# EAGLE board ProiectTSC (EAGLE 9.7.0)
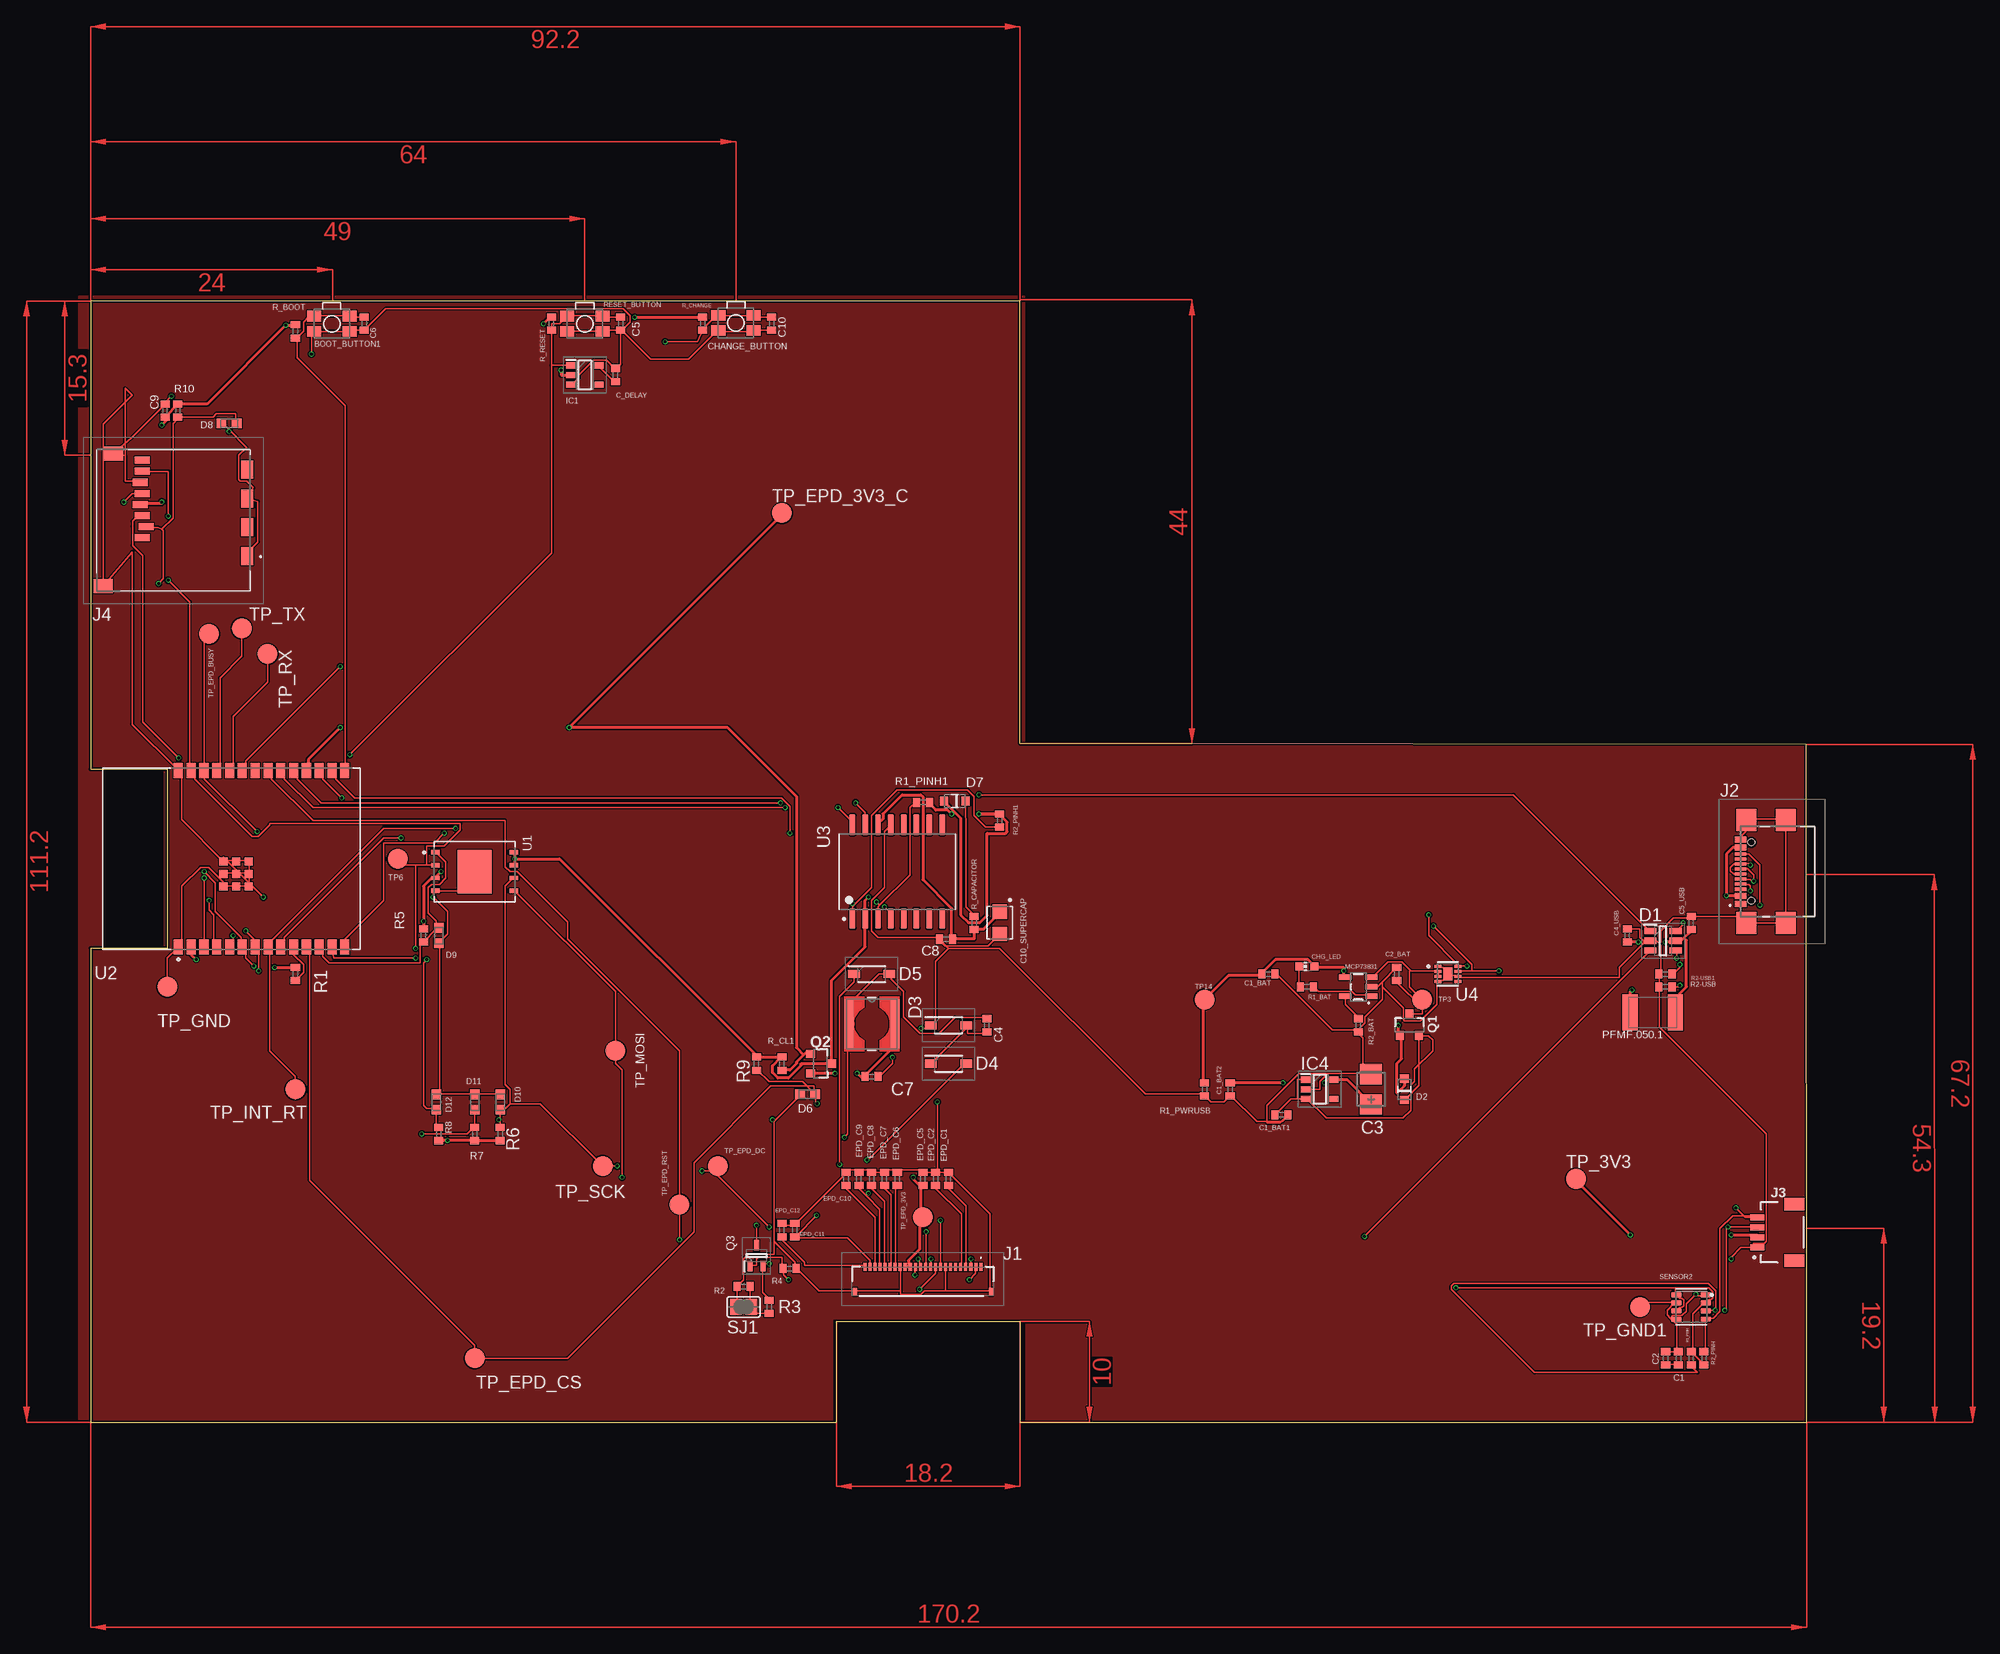
[diagram p3: board, top side]
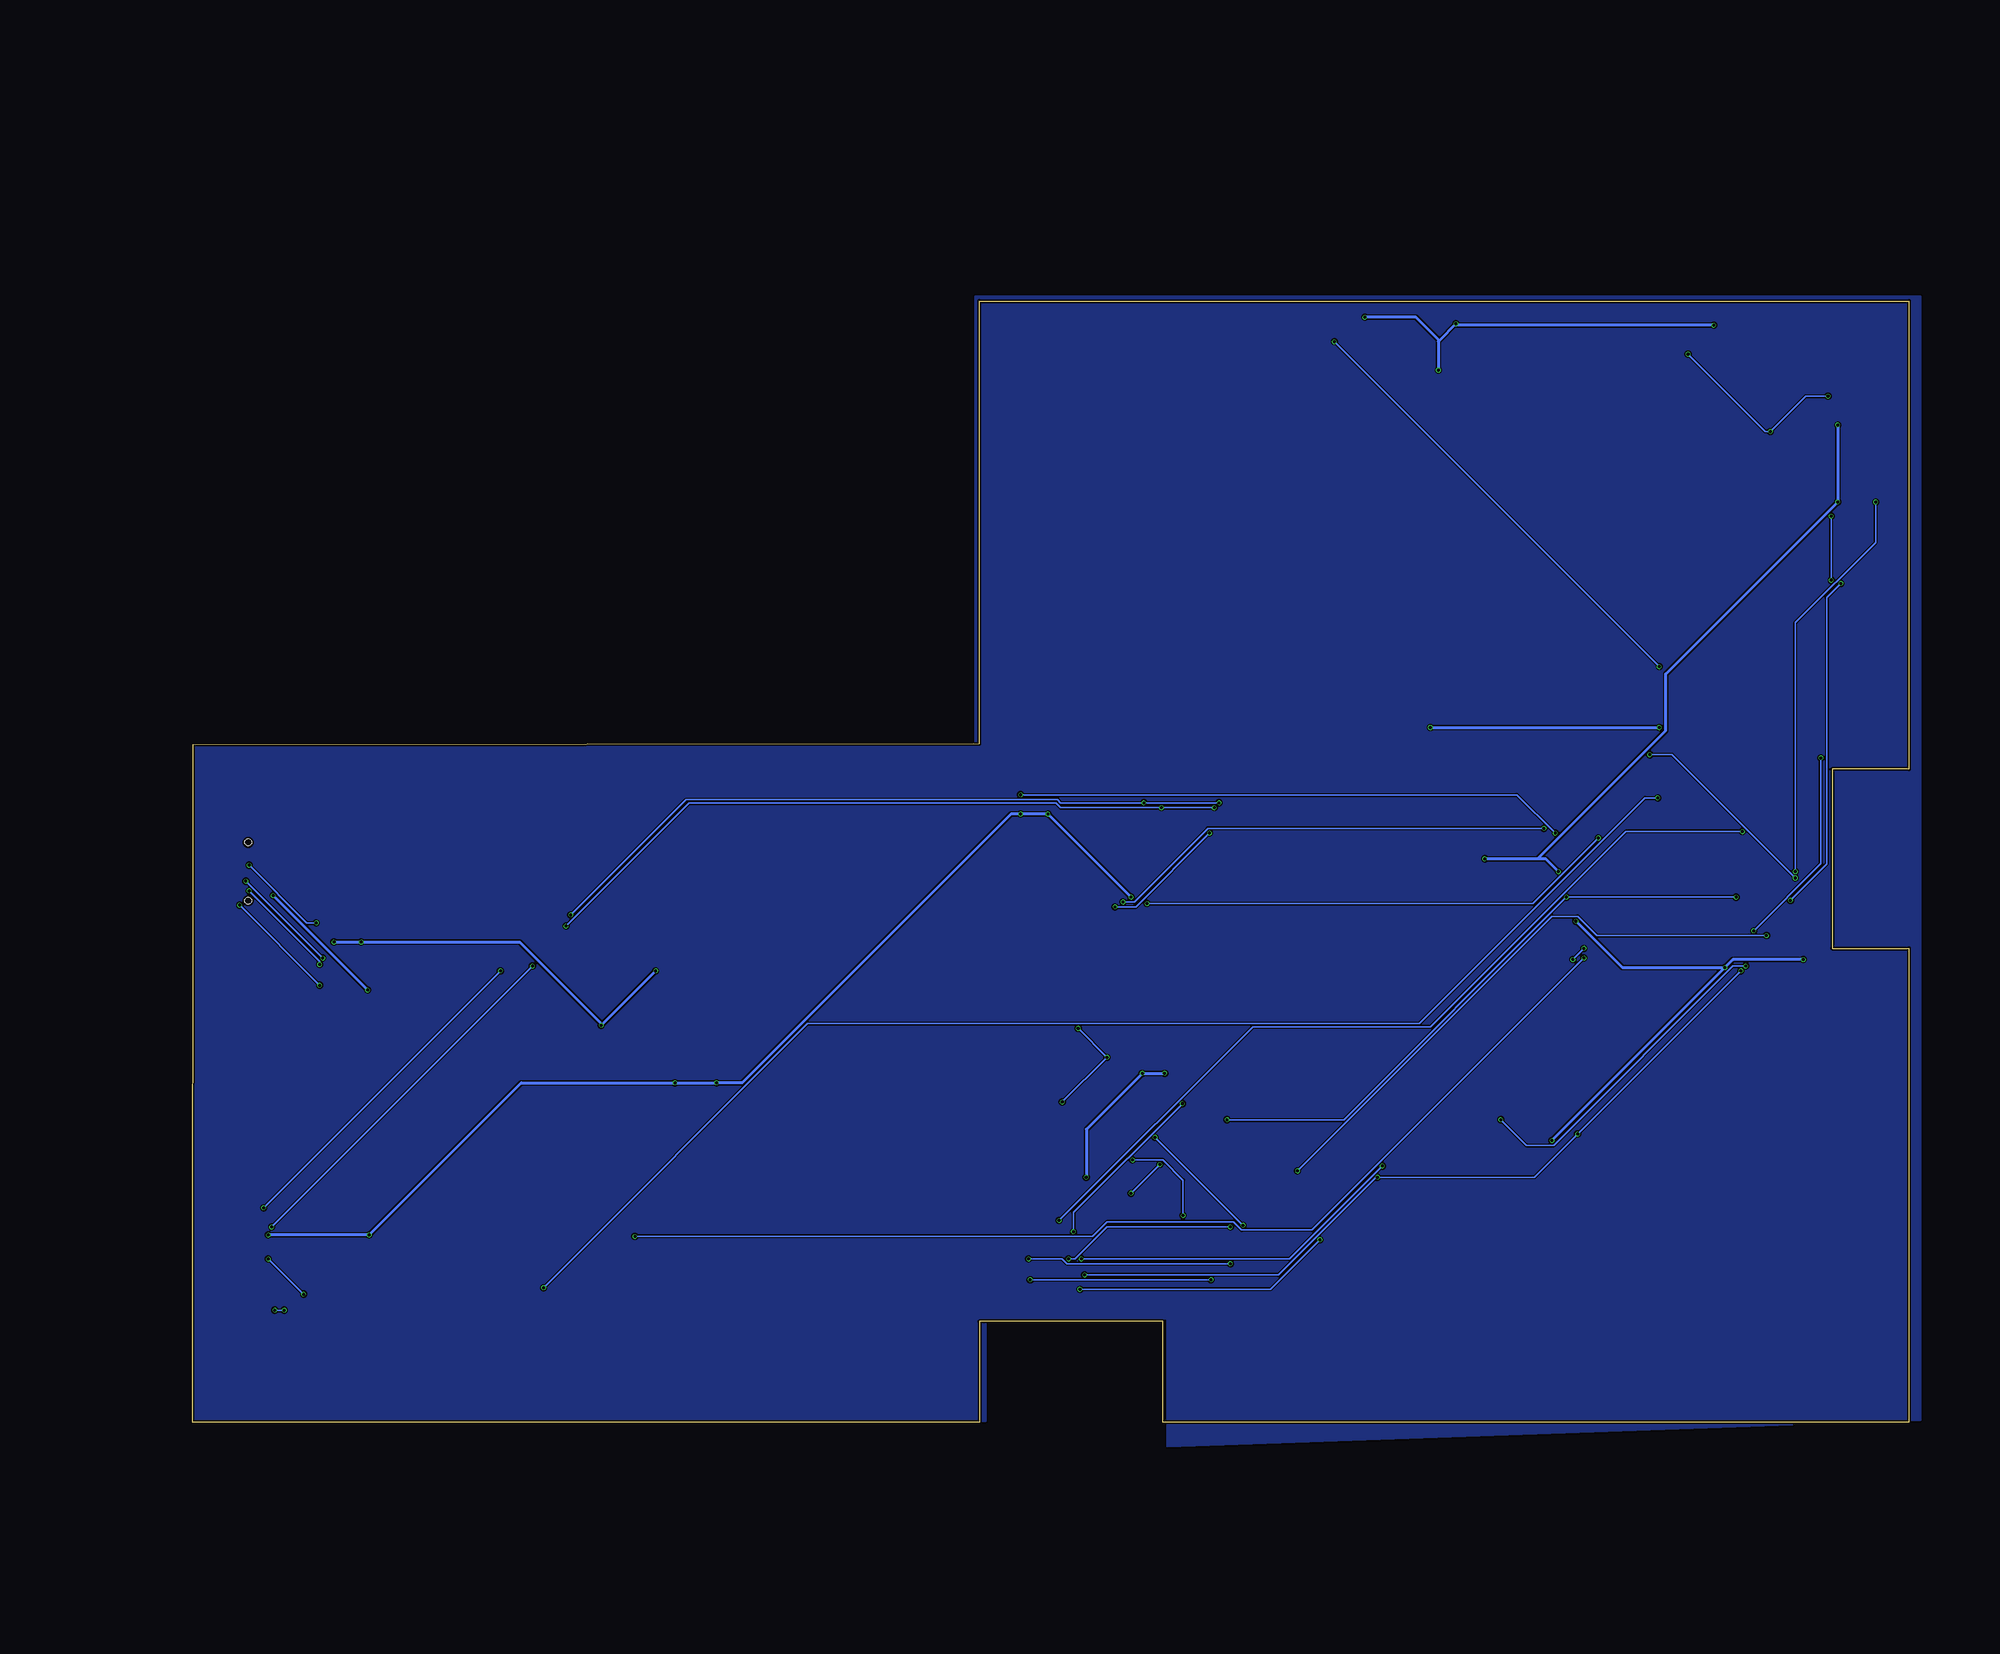
[diagram p4: board, bottom side, seen from below]

Size 170.2 x 111.2 mm. Coordinates in mm from the lower left corner, seen from the top.
Outline: 0,46.99 0,0 74,0 74,10 92.2,10 92.2,0 170.2,0 170.16,67.2 92.2,67.31 92.2,111.2 0,111.2 0,64.77 7.62,64.77 7.62,46.99 0,46.99
Copper layers (1*16): Top 0.035mm / dielectric 1.6mm / Bottom 0.035mm
Design rules "jlcpcb-2layers.dru": minimum track width 5mil, minimum drill 0.3mm, track to track 5mil, track to pad 5mil, pad to pad 5mil, via to via 5mil, smd to smd 5mil, copper to edge 0.2mm, drill to drill 6mil, minimum pad ring 10mil, minimum via ring 3mil, stop-mask expansion 4mil, vias tented up to drill 0mil, thermal gap 10mil
Net classes: 0 default: width 0.15 mm; 1 POWER: width 0.3 mm

## Footprints (pad centres in the part's own frame; a part is rotated, then mirrored left to right if it is on the bottom)
MYBUTTON = smd 1.4 x 1.05: 1 1.75,0.75; 2 -1.75,0.75; 3 -1.75,-0.75; 4 1.75,-0.75
EAGLE-LTSPICE_C0402 = smd 0.7 x 0.9: 1 -0.65,0; 2 0.65,0
ESP32_WROVER_EAGLE-LTSPICE_C0402 = smd 0.7 x 0.9: 1 -0.65,0; 2 0.65,0
RCL_CT3528 = smd 2 x 2.2: + -1.5,0; - 1.5,0
CAPCP3225X100N = smd 1.4 x 1.4: 1 -1.1,0; 2 1.1,0
ADAFRUIT_CHIP-LED0603 = smd 0.8 x 0.8: A 0,-0.75; C 0,0.75
SOT95P280X145-6N = smd 1.2 x 0.6: 1 -1.25,0.95; 2 -1.25,0; 3 -1.25,-0.95; 4 1.25,-0.95; 5 1.25,0; 6 1.25,0.95
ESP32_WROVER_AVX---SD0805S020S1R0_AVX_SD0805S020S1R0_0 = smd 0.8 x 0.9: 1 -1.05,0; 2 1.05,0
SOD3716X135N = smd 1.15 x 0.8: 1 -1.75,0; 2 1.75,0
DIOC1608X36N = smd 0.97 x 0.94: 1 -0.75,0; 2 0.75,0
SOT95P280X125-5N = smd 0.9 x 0.6: 1 -1.4,0.95; 2 -1.4,0; 3 -1.4,-0.95; 4 1.4,-0.95; 5 1.4,0.95
SOT95P280X120-5N = smd 0.9 x 0.6: 1 -1.4,0.95; 2 -1.4,0; 3 -1.4,-0.95; 4 1.4,-0.95; 5 1.4,0.95
FH34SRJ24S05SH99 = smd 0.3 x 0.8: 1 5.75,1.45; 2 5.25,1.45; 3 4.75,1.45; 4 4.25,1.45; 5 3.75,1.45; 6 3.25,1.45; 7 2.75,1.45; 8 2.25,1.45; 9 1.75,1.45; 10 1.25,1.45; 11 0.75,1.45; 12 0.25,1.45; 13 -0.25,1.45; 14 -0.75,1.45; 15 -1.25,1.45; 16 -1.75,1.45; 17 -2.25,1.45; 18 -2.75,1.45; 19 -3.25,1.45; 20 -3.75,1.45; 21 -4.25,1.45; 22 -4.75,1.45; 23 -5.25,1.45; 24 -5.75,1.45 | smd 0.4 x 0.8: MP1 6.75,-1.05; MP2 -6.75,-1.05
SAMACSYS_PARTS_USB4110GFA = smd 0.3 x 1.15: A1 -3.35,3.678; A4 -2.55,3.678; A5 -1.25,3.678; A6 -0.25,3.678; A7 0.25,3.678; A8 1.25,3.678; A9 2.55,3.678; A12 3.35,3.678; B1 3.05,3.678; B4 2.25,3.678; B5 1.75,3.678; B6 0.75,3.678; B7 -0.75,3.678; B8 -1.75,3.678; B9 -2.25,3.678; B12 -3.05,3.678 | smd 2.18 x 2: MP1 -5.11,-0.827; MP2 5.11,-0.827; MP3 -5.11,3.103; MP4 5.11,3.103 | hole 0.65: -2.89,2.603; 2.89,2.603
JST04_1MM_RA = smd 0.6 x 1.35: 1 -1.5,0; 2 -0.5,0; 3 0.5,0; 4 1.5,0 | smd 1.2 x 2: NC1 2.8,-3.675; NC2 -2.8,-3.675
112ATAARR03ATTEND = smd 1.8 x 1.2: G1 10.6,10.4; G2 4.9,10.4; S1 7.75,10.4; S2 2.05,10.4 | smd 1.4 x 1.9: G3 13.6,-3.85; G4 0.45,-2.85 | smd 0.7 x 1.5: P1 8.8,0; P2 7.7,0.4; P3 6.6,0; P4 5.5,-0.2; P5 4.4,0; P6 3.3,-0.2; P7 2.2,0; P8 1.1,0
IND_4828-WE-TPC_WRE = smd 0.889 x 4.826: 1 -2.286,0; 2 2.286,0
ESP32_WROVER_SPARKFUN-IC-POWER_SOT23-5 = smd 0.55 x 1.2: 1 -0.95,-1.3; 2 0,-1.3; 3 0.95,-1.3; 4 0.95,1.3; 5 -0.95,1.3
ESP32C6_VARISTOR_CT/CN1812 = smd 1.5 x 3.6: 1 -2.25,0; 2 2.25,0
ESP32_WROVER_SPARKFUN-DISCRETESEMI_SOT23-3 = smd 0.8 x 0.9: 1 -0.95,-1; 2 0.95,-1; 3 0,1.1
SOT65P210X110-3N = smd 1.05 x 0.5: 1 -1.05,0.65; 2 -1.05,-0.65; 3 1.05,0
ESP32_WROVER_EAGLE-LTSPICE_R0402 = smd 0.7 x 0.9: 1 -0.65,0; 2 0.65,0
ESP32_WROVER_BME680_PSON80P300X300X100-8N = smd 1.016 x 0.5: 1 1.458,1.2; 2 1.458,0.4; 3 1.458,-0.4; 4 1.458,-1.2; 5 -1.458,-1.22; 6 -1.458,-0.4; 7 -1.458,0.4; 8 -1.458,1.2
SJ = smd 1.168 x 1.6: 1 -0.762,0; 2 0.762,0
TP20R = smd 2 x 2: TP 0,0
SON127P600X800X80-9N = smd 0.94 x 0.44: 1 -3.895,1.905; 2 -3.895,0.635; 3 -3.895,-0.635; 4 -3.895,-1.905; 5 3.895,-1.905; 6 3.895,-0.635; 7 3.895,0.635; 8 3.895,1.905 | smd 3.4 x 4.3: 9 0,0
XCVR_ESP32-C6-WROOM-1-N8 = smd 1.5 x 0.9: 1 -8.75,5.26; 2 -8.75,3.99; 3 -8.75,2.72; 4 -8.75,1.45; 5 -8.75,0.18; 6 -8.75,-1.09; 7 -8.75,-2.36; 8 -8.75,-3.63; 9 -8.75,-4.9; 10 -8.75,-6.17; 11 -8.75,-7.44; 12 -8.75,-8.71; 13 -8.75,-9.98; 14 -8.75,-11.25; 15 8.75,-11.25; 16 8.75,-9.98; 17 8.75,-8.71; 18 8.75,-7.44; 19 8.75,-6.17; 20 8.75,-4.9; 21 8.75,-3.63; 22 8.75,-2.36; 23 8.75,-1.09; 24 8.75,0.18; 25 8.75,1.45; 26 8.75,2.72; 27 8.75,3.99; 28 8.75,5.26 | smd 0.8 x 0.8: 29_1 -2.755,0.79; 29_2 -1.505,0.79; 29_3 -0.255,0.79; 29_4 -2.755,-0.46; 29_5 -1.505,-0.46; 29_6 -0.255,-0.46; 29_7 -2.755,-1.71; 29_8 -1.505,-1.71; 29_9 -0.255,-1.71
SOIC127P1032X265-16N = smd 2.05 x 0.59: 1 -4.655,4.445; 2 -4.655,3.175; 3 -4.655,1.905; 4 -4.655,0.635; 5 -4.655,-0.635; 6 -4.655,-1.905; 7 -4.655,-3.175; 8 -4.655,-4.445; 9 4.655,-4.445; 10 4.655,-3.175; 11 4.655,-1.905; 12 4.655,-0.635; 13 4.655,0.635; 14 4.655,1.905; 15 4.655,3.175; 16 4.655,4.445
SON50P200X200X80-9N = smd 0.76 x 0.27: 1 -0.985,0.75; 2 -0.985,0.25; 3 -0.985,-0.25; 4 -0.985,-0.75; 5 0.985,-0.75; 6 0.985,-0.25; 7 0.985,0.25; 8 0.985,0.75 | smd 0.9 x 1.3: 9 0,0

## Placement (x,y rotation side)
BOOT_BUTTON1  BUTTON_CUSYOMV1  [MYBUTTON]  23.93,108.95 180 top
C1  100nF  [EAGLE-LTSPICE_C0402]  157.48,6.35 90 top
C1_BAT  4.7uF  [ESP32_WROVER_EAGLE-LTSPICE_C0402]  116.84,44.45 0 top
C1_BAT1  4.7uF  [ESP32_WROVER_EAGLE-LTSPICE_C0402]  118.11,30.48 0 top
C1_BAT2  4.7uF  [ESP32_WROVER_EAGLE-LTSPICE_C0402]  113.03,33.02 270 top
C2  100nF  [EAGLE-LTSPICE_C0402]  156.21,6.35 90 top
C2_BAT  4.7uF  [EAGLE-LTSPICE_C0402]  129.54,44.45 90 top
C3  100uF  [RCL_CT3528]  127,33.02 90 top
C4  4.7uF/25V  [ESP32_WROVER_EAGLE-LTSPICE_C0402]  88.9,39.37 90 top
C4_USB  100nF  [EAGLE-LTSPICE_C0402]  152.4,48.26 90 top
C5  1uF  [EAGLE-LTSPICE_C0402]  52.58,108.95 270 top
C5_USB  4.7uF  [EAGLE-LTSPICE_C0402]  158.75,49.53 90 top
C6  100nF  [EAGLE-LTSPICE_C0402]  27.14,108.95 270 top
C7  10uF  [ESP32_WROVER_EAGLE-LTSPICE_C0402]  77.47,34.29 0 top
C8  100nF  [EAGLE-LTSPICE_C0402]  84.84,47.9 180 top
C9  100nF  [EAGLE-LTSPICE_C0402]  7.39,100.33 90 top
C10  100nF  [EAGLE-LTSPICE_C0402]  67.56,108.95 270 top
C10_SUPERCAP  CPH3225A  [CAPCP3225X100N]  90.17,49.53 270 top
C_DELAY  100nF  [EAGLE-LTSPICE_C0402]  52.07,103.87 90 top
CHANGE_BUTTON  BUTTON_CUSYOMV1  [MYBUTTON]  64.01,109.04 180 top
CHG_LED  [ADAFRUIT_CHIP-LED0603]  120.65,45.21 90 top
D1  USBLC6-2SC6Y  [SOT95P280X145-6N]  155.96,47.75 0 top
D2  ESP32_WROVER_AVX---SD0805S020S1R0_AVX_SD0805S020S1R0_0_0AVX_SD0805S020S1R0_0_0  [ESP32_WROVER_AVX---SD0805S020S1R0_AVX_SD0805S020S1R0_0]  130.3,33.02 90 top
D3  MBR0530  [SOD3716X135N]  85.09,39.37 0 top
D4  MBR0530  [SOD3716X135N]  85.09,35.56 0 top
D5  MBR0530  [SOD3716X135N]  77.47,44.45 0 top
D6  PGB1010603MR  [DIOC1608X36N]  71.12,32.51 0 top
D7  ESP32_WROVER_AVX---SD0805S020S1R0_AVX_SD0805S020S1R0_0_0AVX_SD0805S020S1R0_0_0  [ESP32_WROVER_AVX---SD0805S020S1R0_AVX_SD0805S020S1R0_0]  85.71,61.59 180 top
D8  PGB1010603MR  [DIOC1608X36N]  13.74,99.06 0 top
D9  PGB1010603MR  [DIOC1608X36N]  34.54,48.26 90 top
D10  PGB1010603MR  [DIOC1608X36N]  40.64,31.75 270 top
D11  PGB1010603MR  [DIOC1608X36N]  38.1,31.75 270 top
D12  PGB1010603MR  [DIOC1608X36N]  34.29,31.75 270 top
EPD_C1  1uF/50V  [EAGLE-LTSPICE_C0402]  85.09,24.13 90 top
EPD_C2  1uF/50V  [EAGLE-LTSPICE_C0402]  83.82,24.13 90 top
EPD_C5  0.1uF/50V  [EAGLE-LTSPICE_C0402]  82.55,24.13 90 top
EPD_C6  1uF/50V  [EAGLE-LTSPICE_C0402]  80.01,24.13 90 top
EPD_C7  1uF/50V  [EAGLE-LTSPICE_C0402]  78.74,24.13 90 top
EPD_C8  1uF/50V  [EAGLE-LTSPICE_C0402]  77.47,24.13 90 top
EPD_C9  1uF/50V  [EAGLE-LTSPICE_C0402]  76.2,24.13 90 top
EPD_C10  1uF/50V  [EAGLE-LTSPICE_C0402]  74.93,24.13 90 top
EPD_C11  1uF/50V  [EAGLE-LTSPICE_C0402]  69.85,19.05 90 top
EPD_C12  1uF/50V  [EAGLE-LTSPICE_C0402]  68.58,19.05 90 top
IC1  BD5229G-TR  [SOT95P280X125-5N]  49.02,103.87 0 top
IC4  XC6220A331MR-G  [SOT95P280X120-5N]  121.92,33.02 0 top
J1  FH34SRJ-24S-0.5SH_99_  [FH34SRJ24S05SH99]  82.55,13.97 0 top
J2  SAMACSYS_PARTS_USB4110-GF-A  [SAMACSYS_PARTS_USB4110GFA]  167.32,54.61 90 top
J3  QWIIC_RIGHT_ANGLE  [JST04_1MM_RA]  165.31,18.83 90 top
J4  112A-TAAR-R03_ATTEND  [112ATAARR03ATTEND]  5.12,96.52 270 top
L1  68uH  [IND_4828-WE-TPC_WRE]  77.5,39.5 0 top
MCP73831  ESP32_WROVER_SPARKFUN-IC-POWER_MCP73831  [ESP32_WROVER_SPARKFUN-IC-POWER_SOT23-5]  125.73,43.18 90 top
PFMF.050.1  ESP32C6_VARISTORCN1812  [ESP32C6_VARISTOR_CT/CN1812]  154.94,40.64 0 top
Q1  20V/4.2A/52mΩ/1.4W  [ESP32_WROVER_SPARKFUN-DISCRETESEMI_SOT23-3]  130.81,39.37 0 top
Q2  20V/4.2A/52mΩ/1.4W  [ESP32_WROVER_SPARKFUN-DISCRETESEMI_SOT23-3]  72.39,35.56 270 top
Q3  SI1308EDL-T1-GE3  [SOT65P210X110-3N]  66.04,16.51 90 top
R1  10k  [ESP32_WROVER_EAGLE-LTSPICE_R0402]  20.32,44.45 90 top
R1_BAT  200  [ESP32_WROVER_EAGLE-LTSPICE_R0402]  120.65,43.18 0 top
R1_PINH  10K  [ESP32_WROVER_EAGLE-LTSPICE_R0402]  158.75,6.35 90 top
R1_PINH1  10K  [ESP32_WROVER_EAGLE-LTSPICE_R0402]  82.55,61.47 0 top
R1_PWRUSB  10K  [ESP32_WROVER_EAGLE-LTSPICE_R0402]  110.49,33.02 90 top
R2  2.2  [ESP32_WROVER_EAGLE-LTSPICE_R0402]  64.77,13.46 0 top
R2-USB  5k1  [ESP32_WROVER_EAGLE-LTSPICE_R0402]  156.21,43.18 180 top
R2-USB1  5k1  [ESP32_WROVER_EAGLE-LTSPICE_R0402]  156.21,44.45 0 top
R2_BAT  2k  [ESP32_WROVER_EAGLE-LTSPICE_R0402]  125.73,39.37 90 top
R2_PINH  10K  [ESP32_WROVER_EAGLE-LTSPICE_R0402]  160.02,6.35 270 top
R2_PINH1  10K  [ESP32_WROVER_EAGLE-LTSPICE_R0402]  90.17,59.69 90 top
R3  0.47  [ESP32_WROVER_EAGLE-LTSPICE_R0402]  67.31,11.43 90 top
R4  10K  [ESP32_WROVER_EAGLE-LTSPICE_R0402]  69.34,15.24 180 top
R5  10K  [ESP32_WROVER_EAGLE-LTSPICE_R0402]  33.02,48.26 90 top
R6  10K  [ESP32_WROVER_EAGLE-LTSPICE_R0402]  40.64,28.57 270 top
R7  10K  [ESP32_WROVER_EAGLE-LTSPICE_R0402]  38.1,28.57 270 top
R8  10K  [ESP32_WROVER_EAGLE-LTSPICE_R0402]  34.54,28.57 270 top
R9  10K  [ESP32_WROVER_EAGLE-LTSPICE_R0402]  66.04,35.56 90 top
R10  10K  [ESP32_WROVER_EAGLE-LTSPICE_R0402]  8.66,100.33 90 top
R_BOOT  10K  [ESP32_WROVER_EAGLE-LTSPICE_R0402]  20.32,108.19 90 top
R_CAPACITOR  15  [ESP32_WROVER_EAGLE-LTSPICE_R0402]  87.63,49.53 270 top
R_CHANGE  10K  [ESP32_WROVER_EAGLE-LTSPICE_R0402]  60.71,108.95 90 top
R_CL1  10K  [ESP32_WROVER_EAGLE-LTSPICE_R0402]  68.58,35.56 90 top
R_RESET  10K  [ESP32_WROVER_EAGLE-LTSPICE_R0402]  45.72,108.95 90 top
RESET_BUTTON  BUTTON_CUSYOMV1  [MYBUTTON]  49.02,108.95 180 top
SENSOR2  ESP32_WROVER_BME680_BME680  [ESP32_WROVER_BME680_PSON80P300X300X100-8N]  158.75,11.43 0 top
SJ1  [SJ]  64.77,11.43 0 top
TP3  TPTP20R  [TP20R]  132.08,41.91 0 top
TP6  TPTP20R  [TP20R]  30.48,55.88 0 top
TP14  TPTP20R  [TP20R]  110.49,41.91 0 top
TP_3V3  TPTP20R  [TP20R]  147.32,24.13 0 top
TP_EPD_3V3  TPTP20R  [TP20R]  82.55,20.32 0 top
TP_EPD_3V3_C  TPTP20R  [TP20R]  68.58,90.17 0 top
TP_EPD_BUSY  TPTP20R  [TP20R]  11.76,78.18 0 top
TP_EPD_CS  TPTP20R  [TP20R]  38.1,6.35 0 top
TP_EPD_DC  TPTP20R  [TP20R]  62.23,25.4 0 top
TP_EPD_RST  TPTP20R  [TP20R]  58.42,21.59 0 top
TP_GND  TPTP20R  [TP20R]  7.62,43.18 0 top
TP_GND1  TPTP20R  [TP20R]  153.67,11.43 0 top
TP_INT_RT  TPTP20R  [TP20R]  20.32,33.02 0 top
TP_MOSI  TPTP20R  [TP20R]  52.07,36.83 0 top
TP_RX  TPTP20R  [TP20R]  17.55,76.2 0 top
TP_SCK  TPTP20R  [TP20R]  50.8,25.4 0 top
TP_TX  TPTP20R  [TP20R]  15.01,78.74 0 top
U1  W25Q512JVEIQ  [SON127P600X800X80-9N]  38.1,54.61 0 top
U2  ESP32-C6-WROOM-1-N8  [XCVR_ESP32-C6-WROOM-1-N8]  13.97,55.88 90 top
U3  DS3231SN#  [SOIC127P1032X265-16N]  80.01,54.61 90 top
U4  MAX17048G+T10  [SON50P200X200X80-9N]  134.62,44.45 0 top

## Tracks (layer width: path | path; a pad name or v marks a point on that pad's centre or on a via)
3V3  (via drill 0.3)
  Top 0.3: IC1.2 46.67,103.87 v46.67,104.35 | v44.93,108.95 45.72,109.74 R_RESET.2 | v53.98,109.58 60.64,109.58 R_CHANGE.2 | R_BOOT.2 20.32,108.79 v19.37,108.79 11.56,100.98 R10.2 8.66,100.97 7.39,99.69 C9.1 7.55,99.69 7.55,99.38 v7.07,98.9 | v7.07,91.28 7.07,91.12 4.96,91.12 J4.P4 | v118.27,33.66 113.03,33.66 C1_BAT2.1 | v122.4,33.66 122.71,33.97 123.19,33.97 IC4.5 123.35,33.97 124.62,33.97 127,31.59 C3.+ | v162.72,18.57 165.31,18.57 J3.2 | v152.72,18.57 147.32,23.97 TP_3V3.TP | R2_PINH1.2 90.17,60.33 v88.11,60.33 90.08,60.33 90.9,59.51 90.9,58.58 90.73,58.41 88.92,58.41 88.92,50.27 88.19,49.55 87.06,49.55 86.29,50.33 86.29,59.91 84.66,61.55 D7.2 | v77.15,52.07 76.83,51.75 U3.2 76.83,47.15 73.5,43.81 73.5,35.56 Q2.3 70.48,35.56 70.48,35.4 69.22,34.13 68.17,34.13 67.63,34.67 67.63,35.36 68.48,36.21 R_CL1.2 68.58,36.2 66.04,36.2 R9.2 66.04,36.35 46.51,55.88 v42.07,55.88 | v42.07,55.88 42.07,56.52 U1.8 | v42.07,55.88 42.07,55.24 U1.7 | R5.2 v33.02,49.69 33.02,53.18 33.81,53.98 U1.3 34.29,53.98 34.29,54.13 v34.77,54.61 | R7.2 v35.4,27.94 34.61,27.94 R8.2 | R7.2 R6.2 | R7.2 | v18.26,45.09 20.32,45.09 R1.2 | v10.48,45.88 10,46.35 10,46.99 U2.2 | v85.41,60.33 85.02,60.72 83.85,60.72 83.2,61.37 R1_PINH1.2
  Bottom 0.3: v46.67,104.35 46.67,107.2 46.59,107.28 | 46.59,107.28 v44.93,108.95 44.93,108.79 v19.37,108.79 | v53.98,109.58 48.9,109.58 46.59,107.28 | v7.07,98.9 v7.07,91.28 24.13,74.22 24.13,68.58 36.83,55.88 | v162.72,18.57 v152.72,18.57 137.64,33.66 v122.4,33.66 v118.27,33.66 115.73,33.66 89.06,60.33 v88.11,60.33 v85.41,60.33 v77.15,52.07 | 36.83,55.88 36.04,55.88 v34.77,54.61 | 36.83,55.88 v42.07,55.88 | v18.26,45.09 17.46,45.88 v10.48,45.88 | v18.26,45.09 v35.4,27.94 | v33.02,49.69 28.42,45.09 v18.26,45.09
32KHZ  (via drill 0.3)
  Top 0.15: 75.72,51.28 75.56,51.12 U3.1 | 75.72,51.28 77.47,53.02 77.47,60.19 79.98,62.71 87,62.71 87.63,62.07 87.63,60.2 88.77,59.05 90.17,59.05 R2_PINH1.1 | v30.8,57.94 29.05,57.94 19.21,48.1 19.21,47.47 18.89,47.15 U2.9 | 75.72,51.28 v75.56,51.44
  Bottom 0.15: v30.8,57.94 37.31,51.44 v75.56,51.44
DN  (via drill 0.3)
  Top 0.15: 164.62,53.82 163.67,53.82 J2.B7 | 164.62,54.61 164.31,54.93 163.67,54.93 J2.A7 | v157.32,46.04 157.32,46.67 D1.4
  Top 0.152: 164.62,54.61 164.94,54.29 v164.94,53.66 164.78,53.66 164.62,53.82
  Bottom 0.15: v164.94,53.66 v157.32,46.04
DP  (via drill 0.3)
  Top 0.15: v157.96,49.53 157.96,49.37 157.32,48.74 D1.6 | v164.62,55.24 164.47,55.4 163.67,55.4 J2.B6
  Top 0.152: J2.A6 162.96,54.36 162.65,54.67 162.65,55.01 163,55.36 J2.B6
  Bottom 0.15: v157.96,49.53 158.91,49.53 v164.62,55.24
EPD_3V3  (via drill 0.3)
  Top 0.3: J1.16 80.8,15.4 81.28,15.4 J1.15 81.28,15.56 81.12,15.72 81.12,16.03 82.23,17.14 82.23,19.37 82.39,19.53 82.39,20.32 TP_EPD_3V3.TP 82.39,20.48 82.39,23.18 82.55,23.34 EPD_C5.1 82.39,23.34 81.6,24.13 v81.6,24.29 | v73.82,34.61 71.44,34.61 Q2.2 | v76.04,34.61 76.52,34.13 76.68,34.13 76.68,34.29 C7.1 | 76.83,34.29 C7.1 | L1.2 79.79,37.36 76.83,34.41 76.83,34.29 | 76.83,34.29 C7.1 | 76.83,34.29 C7.1 | 76.83,34.29 C7.1 | 76.83,34.29 C7.1 | C7.1 76.83,34.29 | C7.1 76.83,34.29 | C7.1 76.83,34.29
  Bottom 0.3: v73.82,34.61 v76.04,34.61 81.6,29.05 v81.6,24.29
EPD_3V3_C  (via drill 0.3)
  Top 0.3: 70.72,36.43 70.96,36.67 71.28,36.67 71.28,36.51 Q2.1 | 70.72,36.43 70.01,35.72 70.01,35.56 69.37,34.92 68.58,34.92 R_CL1.1 | v24.77,68.9 21.59,65.72 21.59,64.93 21.43,64.77 U2.18 | TP_EPD_3V3_C.TP 68.58,90.01 v47.47,68.9 63.18,68.9 70.01,62.07 70.01,37.15 70.72,36.43
  Bottom 0.3: v47.47,68.9 v24.77,68.9
EPD_BUSY  (via drill 0.3)
  Top 0.15: v84.3,20 84.3,15.56 J1.9 | v16.51,58.58 11.27,63.82 11.27,64.61 U2.26 11.27,64.77 11.27,77.7 11.68,78.11 TP_EPD_BUSY.TP
  Bottom 0.15: v84.3,20 65.09,39.21 47.47,39.21 28.1,58.58 v16.51,58.58
EPD_CS  (via drill 0.3)
  Top 0.15: v82.87,18.89 82.87,15.56 J1.12 | v72.07,31.59 71.91,31.75 71.91,32.38 D6.2 | D6.2 71.75,32.54 71.75,33.34 67.47,33.34 59.85,25.72 59.85,18.89 47.31,6.35 TP_EPD_CS.TP 38.1,7.62 21.75,23.97 21.75,46.67 21.43,46.99 U2.11 | R9.1 66.14,34.91 67.28,33.77 70.59,33.77 71.86,32.51 D6.2
  Bottom 0.15: v82.87,18.89 82.87,20.8 v72.07,31.59
EPD_DC  (via drill 0.3)
  Top 0.15: v83.34,16.19 83.34,15.56 J1.11 | v67.31,19.37 62.23,24.45 62.23,24.92 | v14.13,48.26 14.13,47.47 13.81,47.15 U2.5 | 62.23,24.92 v60.64,24.92 | 62.23,24.92 TP_EPD_DC.TP
  Bottom 0.15: v83.34,16.19 82.71,16.19 79.53,19.37 v67.31,19.37 | v14.13,48.26 30.96,48.26 32.86,50.16 35.4,50.16 v60.64,24.92
EPD_RST  (via drill 0.3)
  Top 0.15: v82.23,13.18 83.82,14.76 83.82,15.4 J1.10 | v58.42,18.1 TP_EPD_RST.TP 58.42,36.83 47.31,47.94 47.31,49.61 42.3,54.61 41.59,54.61 41.12,55.09 41.12,59.69 22.07,59.69 17.94,63.82 17.94,64.29 17.62,64.61 U2.21
  Bottom 0.15: v82.23,13.18 63.34,13.18 v58.42,18.1
FLASH_CS
  Top 0.15: 34.29,48.9 34.45,49.05 D9.2 34.29,48.9 | 34.29,48.9 33.02,47.62 | 34.29,48.9 34.29,49.69 33.5,50.48 33.5,53.02 33.81,53.34 34.61,53.34 35.24,53.98 35.24,55.56 34.29,56.52 U1.1 | 33.02,47.62 32.7,47.31 32.7,45.56 23.65,45.56 23.02,46.2 23.02,46.67 22.7,46.99 U2.12 | 33.02,47.62 R5.1
GDR  (via drill 0.3)
  Top 0.15: v87.15,14.13 87.79,14.76 87.79,15.4 J1.2 | v69.22,14.13 68.74,14.61 68.74,15.24 R4.2 68.58,15.24 68.58,16.35 66.2,16.35 66.04,16.19 66.04,15.56 65.41,15.56 Q3.1
  Bottom 0.15: v69.22,14.13 v87.15,14.13
GND  (via drill 0.3)
  Top 0.15: 38.1,32.54 34.61,32.54 | 34.61,32.54 34.29,32.54 D12.1 34.61,32.54 | 38.1,32.54 40.64,32.54 D10.1 | 38.1,32.54 D11.1 | U1.9 38.1,52.7 U1.4 34.13,52.7 33.97,52.55 v33.97,52.07 35.4,50.64 35.4,48.42 34.61,47.62 D9.1 34.61,47.47 34.61,32.54 | TP_GND.TP 7.62,46.04 8.57,46.99 U2.1 8.73,47.15 9.05,47.47 9.05,53.18 10.91,55.04 11.74,55.04 13.18,53.6 U2.29_1 13.34,53.18 14.29,53.18 U2.29_4 14.45,53.18 15.56,53.18 U2.29_7 | U2.29_2 13.34,54.45 14.29,54.45 U2.29_5 14.45,54.45 15.56,54.45 U2.29_8 | 15.72,53.5 15.72,54.29 U2.29_8 | 15.72,53.5 15.72,53.18 U2.29_7 | U2.29_3 13.34,55.72 14.29,55.72 U2.29_6 14.45,55.72 15.56,55.72 U2.29_9 15.72,55.56 15.72,54.45 U2.29_8 | U2.29_3 13.18,55.72 13.18,56.04 v17.14,52.07 | C10.2 67.47,108.31 65.88,108.31 CHANGE_BUTTON.2 65.72,108.16 62.39,108.16 CHANGE_BUTTON.1 62.08,108.2 59.33,105.45 55.53,105.45 52.68,108.3 C5.2 | C5.2 52.55,108.31 50.8,108.31 RESET_BUTTON.2 | IC1.3 | 3.42,95.87 3.42,93.34 4.8,93.34 J4.P6 | 3.42,95.87 J4.G4 4.08,97.66 7.39,100.97 C9.2 7.39,101.12 v8.03,101.76 | 4.13,101.85 3.42,102.55 3.42,95.87 | 15.49,96.68 13.74,98.42 | 13.74,98.42 13.11,99.06 D8.1 | 15.49,93.34 16.15,92.68 J4.G2 16.6,91.33 | v21.91,105.93 21.91,108 22.07,108.16 BOOT_BUTTON1.1 22.23,108.16 25.56,108.16 BOOT_BUTTON1.2 25.72,108.31 26.99,108.31 C6.2 27.15,108.31 27.94,109.11 | 13.74,98.42 v13.74,98.27 | 53.5,109.7 53.5,109.11 52.7,108.31 C5.2 | J4.G3 4.13,86.31 4.13,69.22 8.57,64.77 U2.28 8.73,64.61 9.05,64.29 9.05,59.76 U2.29_3 | v79.53,36.2 79.53,35.56 78.26,34.29 C7.2 | v82.39,39.05 83.19,39.05 83.19,39.37 D3.1 83.82,39.85 83.82,45.72 85.09,46.99
  Top 0.15: 85.09,46.99 84.3,47.78 C8.2 84.14,47.94 84.14,48.1 78.11,48.1 77.47,48.74 77.47,51.75 78.74,53.02 78.74,58.58 79.38,59.21 U3.13 | 85.09,46.99 90.17,46.99 104.62,32.54 110.49,32.54 R1_PWRUSB.1 111.11,31.75 112.41,31.75 C1_BAT2.2 | 85.09,24.77 83.98,24.77 | 83.98,24.77 83.82,24.77 EPD_C2.2 | 84.77,13.02 89.22,13.02 | 84.77,13.02 84.77,15.4 J1.8 | 85.09,24.77 89.22,20.64 89.22,13.02 | 85.09,24.77 EPD_C1.2 | 89.22,13.02 J1.MP1 | SJ1.1 64.14,11.43 64.14,13.34 R2.1 64.14,13.49 64.77,14.13 64.77,16.19 65.25,16.67 67.79,16.67 67.79,17.94 | 80.33,13.02 75.88,13.02 J1.MP2 75.72,13.02 72.23,13.02 70.01,15.24 R4.1 69.85,15.24 69.85,15.88 67.79,17.94 | 80.33,13.02 80.33,15.4 J1.17 | 67.79,29.84 70.33,32.38 D6.1 | 67.79,17.94 67.79,29.84 | 84.77,13.02 82.71,13.02 82.39,12.7 80.33,12.7 80.33,13.02 | 134.62,44.29 134.14,43.81 133.67,43.81 U4.4 133.51,43.66 133.51,41.43 131.89,39.82 130.33,39.82 130.21,39.94 130.21,41.08 128.11,43.18 | 134.62,44.29 135.57,44.29 U4.6 135.73,44.13 151.61,44.13 151.61,45.09 153.99,47.47 153.99,47.78 | 134.62,44.29 U4.9 134.62,44.61 134.14,45.09 133.67,45.09 U4.1 | 128.11,43.66 127.64,43.18 MCP73831.2 | 128.11,43.66 129.54,45.09 C2_BAT.2 | 128.11,43.66 128.11,43.18 | 128.11,43.18 128.11,41.91 126.38,40.18 126.38,39.59 125.89,39.09 125.89,38.42 | C1_BAT1.2 118.75,30.48 117.95,29.69 116.68,29.69 116.68,31.43 119.86,34.61 122.71,34.61 | IC4.2 121.92,33.02 121.92,33.81 122.71,34.61 | 126.21,34.61 127,34.61 C3.- 126.21,34.61 | 126.21,34.61 122.71,34.61 | 125.89,38.42 126.21,38.1 126.21,34.61 | 125.89,38.42 125.73,38.58 R2_BAT.1 | R2_BAT.1 125.73,38.89 123.19,38.89 117.63,44.45 C1_BAT.2
  Top 0.15: 125.89,38.42 R2_BAT.1 | TP_GND1.TP 153.67,11.91 157.16,11.91 SENSOR2.7 157.09,11.83 156.37,11.11 156.37,10.64 156.69,10.32 | 157.32,6.99 157.48,6.99 C1.2 157.32,6.99 | 157.32,6.99 156.21,6.99 C2.2 | 157.32,6.99 157.32,9.68 | 157.32,9.68 157.32,10.16 SENSOR2.5 | SENSOR2.1 160.18,12.54 159.23,12.54 v159.23,12.7 158.28,11.75 158.28,11.01 157.85,10.58 156.95,10.58 156.69,10.32 | v162.72,16.19 162.72,16.35 163.7,17.33 J3.1 164.9,17.74 | 157.32,9.68 156.69,10.32 | J2.B1 163.67,57.78 163.67,57.94 J2.A12 163.67,58.1 164.15,58.58 164.15,59.69 J2.MP4 164.31,59.85 168.12,59.85 J2.MP2 168.12,59.69 168.12,49.53 | 155.57,44.45 155.57,43.18 | 153.99,47.78 154.15,47.62 154.62,47.62 D1.2 154.78,47.78 155.26,47.78 155.57,47.47 | 153.99,47.78 153.67,48.1 153.67,48.9 152.4,48.9 C4_USB.2 | 155.57,44.45 155.73,44.61 155.73,47.31 155.57,47.47 | 155.57,44.45 R2-USB1.1 | J2.B12 163.67,51.44 163.67,51.28 J2.A1 163.67,51.12 163.67,50.16 | 163.67,50.16 164.15,50.16 164.15,49.53 J2.MP3 | 163.67,50.16 158.75,50.16 | 163.67,50.16 J2.MP3 | 168.12,49.53 164.31,49.53 J2.MP3 | 155.57,47.47 155.73,47.62 155.73,48.74 157,50.01 158.75,50.01 158.75,50.16 | 158.75,50.16 C5_USB.2 | 168.12,49.53 J2.MP1 | 164.94,29.84 155.57,39.21 155.57,43.18 | 155.57,43.18 R2-USB.2 | 67.79,29.84 v67.63,30 | 15.72,53.5 U2.29_7 | v83.98,31.75 83.98,24.94 EPD_C2.2 | EPD_C12.2 69,19.5 69.5,19.5 EPD_C11.2 | EPD_C8.2 77.5,25 76.5,25 EPD_C9.2 76,25 75,25 EPD_C10.2 | 80,25 79,25 EPD_C7.2 | 80,25 82.5,25 EPD_C5.2 | 80,25 EPD_C6.2 | 83.98,24.77 EPD_C2.2
  Top 0.152: EPD_C7.2 EPD_C8.2 | EPD_C10.2 74.93,24.68 69.95,19.7 EPD_C11.2 | EPD_C5.2 EPD_C2.2 | 53.5,109.7 53.5,109.77 52.84,110.43 29.26,110.43 27.94,109.11 | 4.13,101.85 1.27,98.99 J4.G3 | 15.49,93.34 14.86,93.34 14.72,93.49 14.72,95.91 15.49,96.68 | J4.G1 15.52,86.22 16.6,87.3 16.6,91.33 | C1_BAT1.2 118.76,30.38 118.21,29.83 115.67,29.83 113.13,32.37 C1_BAT2.2 | 164.9,17.74 165.98,17.74 166.19,17.94 166.19,28.6 164.94,29.84 | C5.2 52.58,104.93 52.17,104.52 C_DELAY.2 51.97,104.52 51.17,105.32 49.89,105.32 48.42,103.85 48.42,103.57 47.77,102.92 IC1.3 | RESET_BUTTON.1 RESET_BUTTON.2 | C10_SUPERCAP.2 88.99,47.25 84.74,47.25 84.19,47.8 C8.2
  Bottom 0.15: v17.14,52.07 v33.97,52.07 56.04,30 v67.63,30 | v21.91,105.93 14.24,98.27 v13.74,98.27 10.25,101.76 v8.03,101.76 | v82.39,39.05 v79.53,36.2 v83.98,31.75 | v159.23,12.7 v162.72,16.19
GPIO8
  Top 0.15: R1.1 20.32,43.81 21.11,44.61 21.11,45.4 20.16,46.35 20.16,46.99 U2.10
I2C_PW  (via drill 0.3)
  Top 0.15: 158.91,6.83 160.02,5.71 R2_PINH.2 | 158.91,6.83 158.75,6.99 R1_PINH.2 158.91,6.83 | v24.92,61.91 23.02,63.82 23.02,64.29 22.7,64.61 U2.17 | 157.16,13.34 v135.41,13.34 | 157.16,13.34 157.16,12.7 SENSOR2.8 157.64,12.28 157.85,12.28 158,12.13 158,11.53 157.85,11.38 157.64,11.38 SENSOR2.6 | 157.16,13.34 160.51,13.34 160.92,12.93 160.92,12.33 160.76,12.18 160.56,12.18 SENSOR2.2 160.12,11.75 159.92,11.75 158.91,10.74 158.91,6.83
  Bottom 0.15: v24.92,61.91 26.19,61.91 48.58,39.53 109.22,39.53 v135.41,13.34
INT_RTC  (via drill 0.3)
  Top 0.15: 78.26,51.28 78.11,51.12 U3.3 | 78.26,51.28 81.28,54.29 81.28,60.96 81.76,61.44 R1_PINH1.1 | 17.78,46.83 17.62,46.99 U2.8 | 17.78,46.83 17.78,36.83 20.32,34.29 TP_INT_RT.TP | v77.95,51.59 78.26,51.28 | v36.2,58.9 29.07,58.9 17.6,47.43 U2.8 | 17.78,46.83 U2.8
  Bottom 0.15: v77.95,51.59 76.83,51.59 69.53,58.9 v36.2,58.9
IO/BOOT
  Top 0.15: C6.1 26.99,109.58 25.72,109.58 BOOT_BUTTON1.3 25.56,109.74 22.23,109.74 BOOT_BUTTON1.4 22.07,109.58 21.59,109.58 21.11,109.11 | 20.48,107.68 20.32,107.68 R_BOOT.1 | 20.48,107.68 20.48,105.57 25.24,100.81 25.24,64.77 U2.15 | 20.48,107.68 R_BOOT.1 | R_BOOT.1 20.48,107.68
  Top 0.152: 21.11,109.11 21.11,108.23 20.42,107.54 R_BOOT.1
IO/CHANGE  (via drill 0.3)
  Top 0.15: C10.1 67.47,109.58 65.88,109.58 CHANGE_BUTTON.3 65.72,109.74 62.39,109.74 CHANGE_BUTTON.4 62.23,109.74 | 60.8,108.31 R_CHANGE.1 60.2,107.16 v56.99,107.16 | v24.77,74.93 15.4,65.56 15.4,65.09 15.08,64.77 U2.23
  Top 0.152: CHANGE_BUTTON.4 62.23,109.74 62.04,109.74 60.8,108.51 60.8,108.31 R_CHANGE.1
  Bottom 0.15: v56.99,107.16 v24.77,74.93
MISO  (via drill 0.3)
  Top 0.15: R8.1 34.45,29.37 34.29,29.53 D12.2 34.29,31.11 33.34,31.11 33.02,31.43 33.02,45.56 v33.34,45.88 | 32.23,55.24 30.48,55.24 TP6.TP | 32.23,55.24 33.34,55.24 | 33.34,55.24 U1.2 | 33.34,55.24 33.34,57.15 35.08,57.15 36.67,58.74 36.67,59.37 17.78,59.37 17.78,59.24 16.64,58.1 16.03,58.1 10.32,63.82 10.32,64.29 10,64.61 U2.27 9.84,64.77 9.84,81.37 v7.71,83.5 | v7.71,89.85 7.71,94.3 5.12,94.3 J4.P7 | 32.23,55.24 v32.23,46.99
  Bottom 0.15: v7.71,83.5 v7.71,89.85 | v32.23,46.99 v33.34,45.88
MOSI  (via drill 0.3)
  Top 0.15: v81.76,14.61 81.76,15.4 J1.14 | v52.7,24.29 52.7,34.92 52.07,35.56 TP_MOSI.TP 52.07,42.7 42.07,52.7 U1.5 | D11.2 38.1,29.69 R7.1 | v16.67,44.77 16.67,46.67 16.35,46.99 U2.7 16.19,47.15 16.19,47.94 v15.4,48.74 | v8.73,65.88 6.51,68.1
  Top 0.152: 6.51,68.1 5.17,69.45 5.17,85.97 4.17,86.97 4.17,88.85 4.17,89.37 4.72,89.92 J4.P3 | R7.1 38,29.23 37.35,28.57 v32.86,28.57
  Bottom 0.15: v81.76,14.61 62.55,14.61 52.86,24.29 v52.7,24.29 37.15,24.29 v32.86,28.57 v16.67,44.77 | v8.73,65.88 8.73,55.4 v15.4,48.74
N$1  (via drill 0.3)
  Top 0.15: v157.64,45.4 157.64,45.09 157,44.45 R2-USB1.2 | v164.62,52.7 164.62,53.18 164.47,53.34 163.67,53.34 J2.A5
  Bottom 0.15: v157.64,45.4 157.64,45.72 v164.62,52.7
N$2
  Top 0.15: 119.7,32.07 120.49,32.07 IC4.3 120.65,32.07 122.56,30.16 130.18,30.16 130.95,30.94 130.95,33.47 131.3,33.81 131.3,35.02 | 119.7,32.07 119.06,32.07 117.47,30.48 C1_BAT1.1 | 119.7,32.07 119.7,33.97 120.49,33.97 IC4.1 | D2.1 130.35,31.97 131.76,33.38 131.76,38.32 Q1.2
  Top 0.152: 131.3,35.02 133.11,36.83 133.11,37.9 132.69,38.32 131.76,38.32
N$3  (via drill 0.3)
  Top 0.15: R2-USB.1 157.64,43.18 v157.64,43.34 | v165.58,51.28 165.58,55.24 164.47,56.36 163.67,56.36 J2.B5
  Bottom 0.15: v165.58,51.28 v157.64,43.34
N$6
  Top 0.15: CHG_LED.C 119.86,45.09 119.86,43.18 R1_BAT.1
N$7
  Top 0.15: 87,39.21 87,39.37 D3.2 87,39.21 | 87,39.21 87,38.58 88.9,38.58 C4.1 | 87,39.21 D4.1
N$8
  Top 0.15: MCP73831.1 126.87,42.39 125.43,42.39 125.11,42.71 121.77,42.71 R1_BAT.2
N$9
  Top 0.15: EPD_C12.1 68.58,18.1 70.8,15.88 70.8,15.56 76.68,15.56 J1.24
N$10
  Top 0.15: R2_BAT.2 125.73,40.16 124.46,41.43 124.46,42.23 MCP73831.5
N$11
  Top 0.15: EPD_C1.1 85.09,23.18 86.84,21.43 86.84,15.56 J1.4
N$12
  Top 0.15: EPD_C2.1 83.82,23.18 86.36,20.64 86.36,15.56 J1.5
N$13
  Top 0.15: EPD_C10.1 74.93,23.18 77.79,20.32 77.79,15.56 J1.22
N$15
  Top 0.15: EPD_C8.1 77.47,23.18 78.74,21.91 78.74,15.56 J1.20
N$16
  Top 0.15: EPD_C7.1 78.74,23.18 79.38,22.54 79.38,15.56 J1.19
N$17
  Top 0.15: J1.18 79.85,15.56 79.85,23.34 80.01,23.5 EPD_C6.1
N$19
  Top 0.15: C2.1 156.21,5.71 157.48,5.71 C1.1
N$22
  Top 0.15: IC1.5 50.48,104.66 52.07,103.08 C_DELAY.1
N$25
  Top 0.15: R_CAPACITOR.1 87.63,50.32 86.84,51.12 86.84,59.9 86.76,59.97 D7.1
POLY_BOT
  pour Bottom: 170.1,0.08 170.1,67.23 92.69,67.23 92.67,67.25 92.65,67.27 92.63,67.29 92.63,111.68 -1.19,111.68 -1.19,0.16 73.58,-2.46 73.58,10.18 73.6,10.2 73.62,10.22 73.64,10.24 91.46,10.24 91.48,10.22 91.5,10.2 91.52,10.18 91.52,0.08
POLY_TOP
  pour Top: 73.62,10.22 73.64,10.24 92.73,10.24 92.75,10.22 92.77,10.2 92.79,10.18 92.79,0.08 170.1,0.08 170.1,67.23 92.69,67.23 92.67,67.25 92.65,67.27 92.63,67.29 92.63,111.68 -1.19,111.68 -1.19,0.08 73.58,0.08 73.58,10.18 73.6,10.2
PREVGH  (via drill 0.3)
  Top 0.15: 76.99,22.38 76.2,23.18 EPD_C9.1 | 76.99,22.38 78.26,21.11 78.26,15.56 J1.21 | v74.3,25.56 74.3,42.23 75.72,43.65 D5.1 | v77.15,22.7 76.99,22.54 76.99,22.38
  Bottom 0.15: v77.15,22.7 v74.3,25.56
PREVGL  (via drill 0.3)
  Top 0.15: J1.23 77.31,15.56 77.31,16.03 75.09,18.26 69.85,18.26 EPD_C11.1 | 70,18.5 v72,20.5
  Top 0.152: EPD_C11.1 70,18.5 | D4.2 86.67,35.56 77.11,26 v77,26
  Bottom 0.15: v77,26 74,26 72,24 v72,20.5
RESE  (via drill 0.3)
  Top 0.15: v87.31,16.19 87.31,15.56 J1.3 | v67.31,15.72 66.83,15.72 66.83,15.56 Q3.2 66.67,15.4 66.67,12.86 67.31,12.22 R3.2
  Bottom 0.15: v87.31,16.19 83.98,16.19 83.5,15.72 v67.31,15.72
RESE'
  Top 0.15: R3.1 67.31,10.79 65.56,10.79 65.56,11.43 SJ1.2 65.41,11.43 65.41,13.34 R2.2
RESET  (via drill 0.3)
  Top 0.15: C5.1 52.55,109.58 50.8,109.58 RESET_BUTTON.3 50.64,109.74 47.31,109.74 RESET_BUTTON.4 47.15,109.58 46.51,108.95 45.72,108.95 R_RESET.1 45.72,104.82 | 45.72,104.82 47.47,104.82 IC1.1 | v11.27,53.98 11.27,47.15 U2.3 | v25.72,66.2 45.72,86.2 45.72,104.82
  Bottom 0.15: v11.27,53.98 23.5,66.2 v25.72,66.2
RTC_RST  (via drill 0.3)
  Top 0.15: v78.74,51.12 79.38,50.48 U3.4 | U2.16 23.97,64.61 24.29,64.29 24.29,63.82 26.19,61.91 68.55,61.91 69.37,61.09 v69.37,58.42
  Bottom 0.15: v69.37,58.42 76.68,51.12 v78.74,51.12
RX
  Top 0.15: TP_RX.TP 17.55,73.43 14.13,70.01 14.13,65.09 13.81,64.77 U2.24
SCK  (via drill 0.3)
  Top 0.15: v82.07,16.19 82.23,16.03 82.23,15.56 J1.13 | v52.23,25.4 TP_SCK.TP 44.61,31.59 41.59,31.59 | 40.64,30.64 40.64,30 | 40.64,30 R6.1 | 41.59,31.59 41.59,33.02 41.12,33.5 41.12,53.18 41.91,53.98 U1.6 | 40.64,30.64 41.59,31.59 | v16.19,45.24 15.4,46.04 15.4,46.67 15.08,46.99 U2.6 14.92,47.15 14.92,48.1 12.38,50.64 12.38,53.5 v11.27,54.61 | 40.64,30 v40.48,30 | 5.12,92.1 J4.P5 | 40.64,30.64 D10.2
  Top 0.152: v3.31,91.26 4.15,92.1 5.12,92.1
  Bottom 0.15: v82.07,16.19 61.44,16.19 v52.23,25.4 | v16.19,45.24 17.46,45.24 35.24,27.46 37.94,27.46 v40.48,30 | v3.31,91.26 3.31,87.27 11.27,79.3 v11.27,54.61
SCL  (via drill 0.3)
  Top 0.15: v68.9,60.96 22.07,60.96 19.21,63.82 19.21,64.29 18.89,64.61 U2.20 | v74.14,60.96 75.56,59.53 U3.16 | R2_PINH.1 160.02,7.14 160.18,7.3 160.18,10.16 SENSOR2.4 160.34,10.32 160.94,10.32 161.61,10.98 161.61,19.21 162.88,20.48 165.31,20.48 J3.4 164.14,20.33 v163.19,21.27 | v139.7,44.77 137,44.77 | 137,44.77 135.73,44.77 U4.7 | v133.19,49.21 137,45.4 137,44.77
  Bottom 0.15: v68.9,60.96 v74.14,60.96 84.14,60.96 84.61,61.44 120.97,61.44 v133.19,49.21 | v163.19,21.27 v139.7,44.77
SDA  (via drill 0.3)
  Top 0.15: v68.42,61.44 22.86,61.44 20.48,63.82 20.48,64.29 20.16,64.61 U2.19 | v75.88,61.44 76.83,60.48 U3.15 | v136.53,45.24 135.73,45.24 U4.8 135.57,45.24 135.57,45.4 132.72,48.26 v132.72,50.32 | J3.3 165.31,19.37 v162.4,19.37 162.24,19.21 162.24,11.11 v162.08,11.11 | R1_PINH.1 158.75,5.56 159.38,4.92 143.22,4.92 134.99,13.16 134.99,13.51 135.24,13.76 160.47,13.76 161.19,13.04 161.19,11.18 v161.13,11.11 160.34,11.11 SENSOR2.3
  Bottom 0.15: v68.42,61.44 v75.88,61.44 84.14,61.44 84.45,61.75 121.28,61.75 v132.72,50.32 | v162.4,19.37 v136.53,45.24 | v162.08,11.11 v161.13,11.11
SRC  (via drill 0.3)
  Top 0.15: D5.2 79.38,44.45 79.38,43.97 80.64,42.7 80.64,40.19 82.26,38.58 84.14,38.58 85.72,40.16 88.9,40.16 C4.2 | v66.04,19.53 Q3.3 | 75.09,28.57 v74.77,28.26
  Top 0.152: D5.2 78.19,44.45 75.42,41.68 L1.1 75.09,39.37 75.09,28.57
  Bottom 0.15: v74.77,28.26 v66.04,19.53
SS_SD  (via drill 0.3)
  Top 0.15: D8.2 14.38,99.06 14.38,100.01 12.47,100.01 12.15,99.69 8.66,99.69 R10.1 8.66,99.54 8.18,99.06 8.18,89.69 7.07,88.58 | v11.75,51.75 11.75,50.8 12.22,50.32 12.22,47.31 12.38,47.15 U2.4 | v6.75,83.19 7.23,83.66 7.23,88.42 7.07,88.58 | 7.07,88.58 6.7,88.74 5.7,88.74 J4.P2
  Bottom 0.152: v6.75,83.19 8.15,81.79 8.15,55.35 v11.75,51.75
TX
  Top 0.15: TP_TX.TP 15.01,75.97 12.86,73.82 12.86,65.09 12.54,64.77 U2.25
USB_D+  (via drill 0.3)
  Top 0.15: v88.11,62.23 141.13,62.23 154.62,48.74 D1.1 | v35.08,58.42 34.13,57.47 29.05,57.47 29.05,51.75 25.24,47.94 25.24,47.15 U2.14
  Bottom 0.15: v88.11,62.23 38.89,62.23 v35.08,58.42
USB_D-  (via drill 0.3)
  Top 0.15: v126.36,18.41 154.62,46.67 D1.3 | v32.23,46.04 24.12,46.04 | 24.12,46.04 | 24.12,46.04 U2.13
  Bottom 0.15: v126.36,18.41 80.96,18.41 79.53,19.84 66.99,19.84 66.2,19.05 59.21,19.05 v32.23,46.04
VBAT
  Top 0.15: U4.3 133.67,44.29 133.67,44.61 U4.2 133.51,44.77 130.96,44.77 | 132.08,41.12 132.08,40.48 130.81,40.48 Q1.3 | 132.08,41.12 129.54,43.66 C2_BAT.1 | 132.08,41.12 TP3.TP 130.81,43.18 130.81,44.77 130.96,44.77 | MCP73831.3 127.16,44.13 128.68,45.65 130.07,45.65 130.96,44.77
VBUS  (via drill 0.3)
  Top 0.3: v153.51,47.62 152.4,47.62 C4_USB.1 | v156.21,47.62 157.16,47.62 D1.5 157.32,47.78 157.8,47.78 158.04,48.02 | 158.04,48.02 158.75,48.74 C5_USB.1 | 158.04,48.02 158.27,47.78 158.27,43.18 157.64,42.55 157.64,40.96 157.32,40.64 PFMF.050.1.2 | R1_PWRUSB.2 110.49,33.81 110.33,33.97 110.33,41.75 TP14.TP 112.87,44.29 116.05,44.29 116.05,44.45 C1_BAT.1 116.19,44.55 117.53,45.89 120.72,45.89 CHG_LED.A 121.44,45.09 124.3,45.09 v124.3,44.77 124.3,44.13 MCP73831.4 | 130.02,38.26 Q1.1 | v129.7,39.37 129.7,38.58 129.86,38.42 Q1.1 | 130.02,38.26 130.02,36.03 129.57,35.59 129.57,32.65 130.3,33.37 D2.2 | 130.02,38.26 Q1.1
  Bottom 0.3: v156.21,47.62 v153.51,47.62 137.79,47.62 129.7,39.53 v129.7,39.37 v124.3,44.77
VRTC
  Top 0.3: C10_SUPERCAP.1 90.17,50.48 88.58,48.9 87.63,48.9 R_CAPACITOR.2 87.63,47.94 85.57,47.94 C8.1 85.41,47.94 85.41,50.96 82.55,53.82 82.55,62.01 82.33,62.23 80.49,62.23 78.58,60.33 78.58,59.85 78.11,59.37 U3.14
VUSB  (via drill 0.3)
  Top 0.3: J2.A4 163.67,52.07 163.67,52.23 J2.B9 163.51,52.23 v162.24,52.23 162.24,56.36 162.88,56.99 163.51,56.99 J2.B4 163.67,56.99 163.67,57.15 J2.A9 | v152.88,42.86 152.72,42.7 152.72,40.64 PFMF.050.1.1
  Bottom 0.3: v152.88,42.86 v162.24,52.23
(copper drawn outside any net)
  shapes: Top area x13